# EAGLE schematic hackeeg-connector-32 (EAGLE 9.4.0)

## Sheet 1 of 4: HACKEEG 64 Position Connector Board
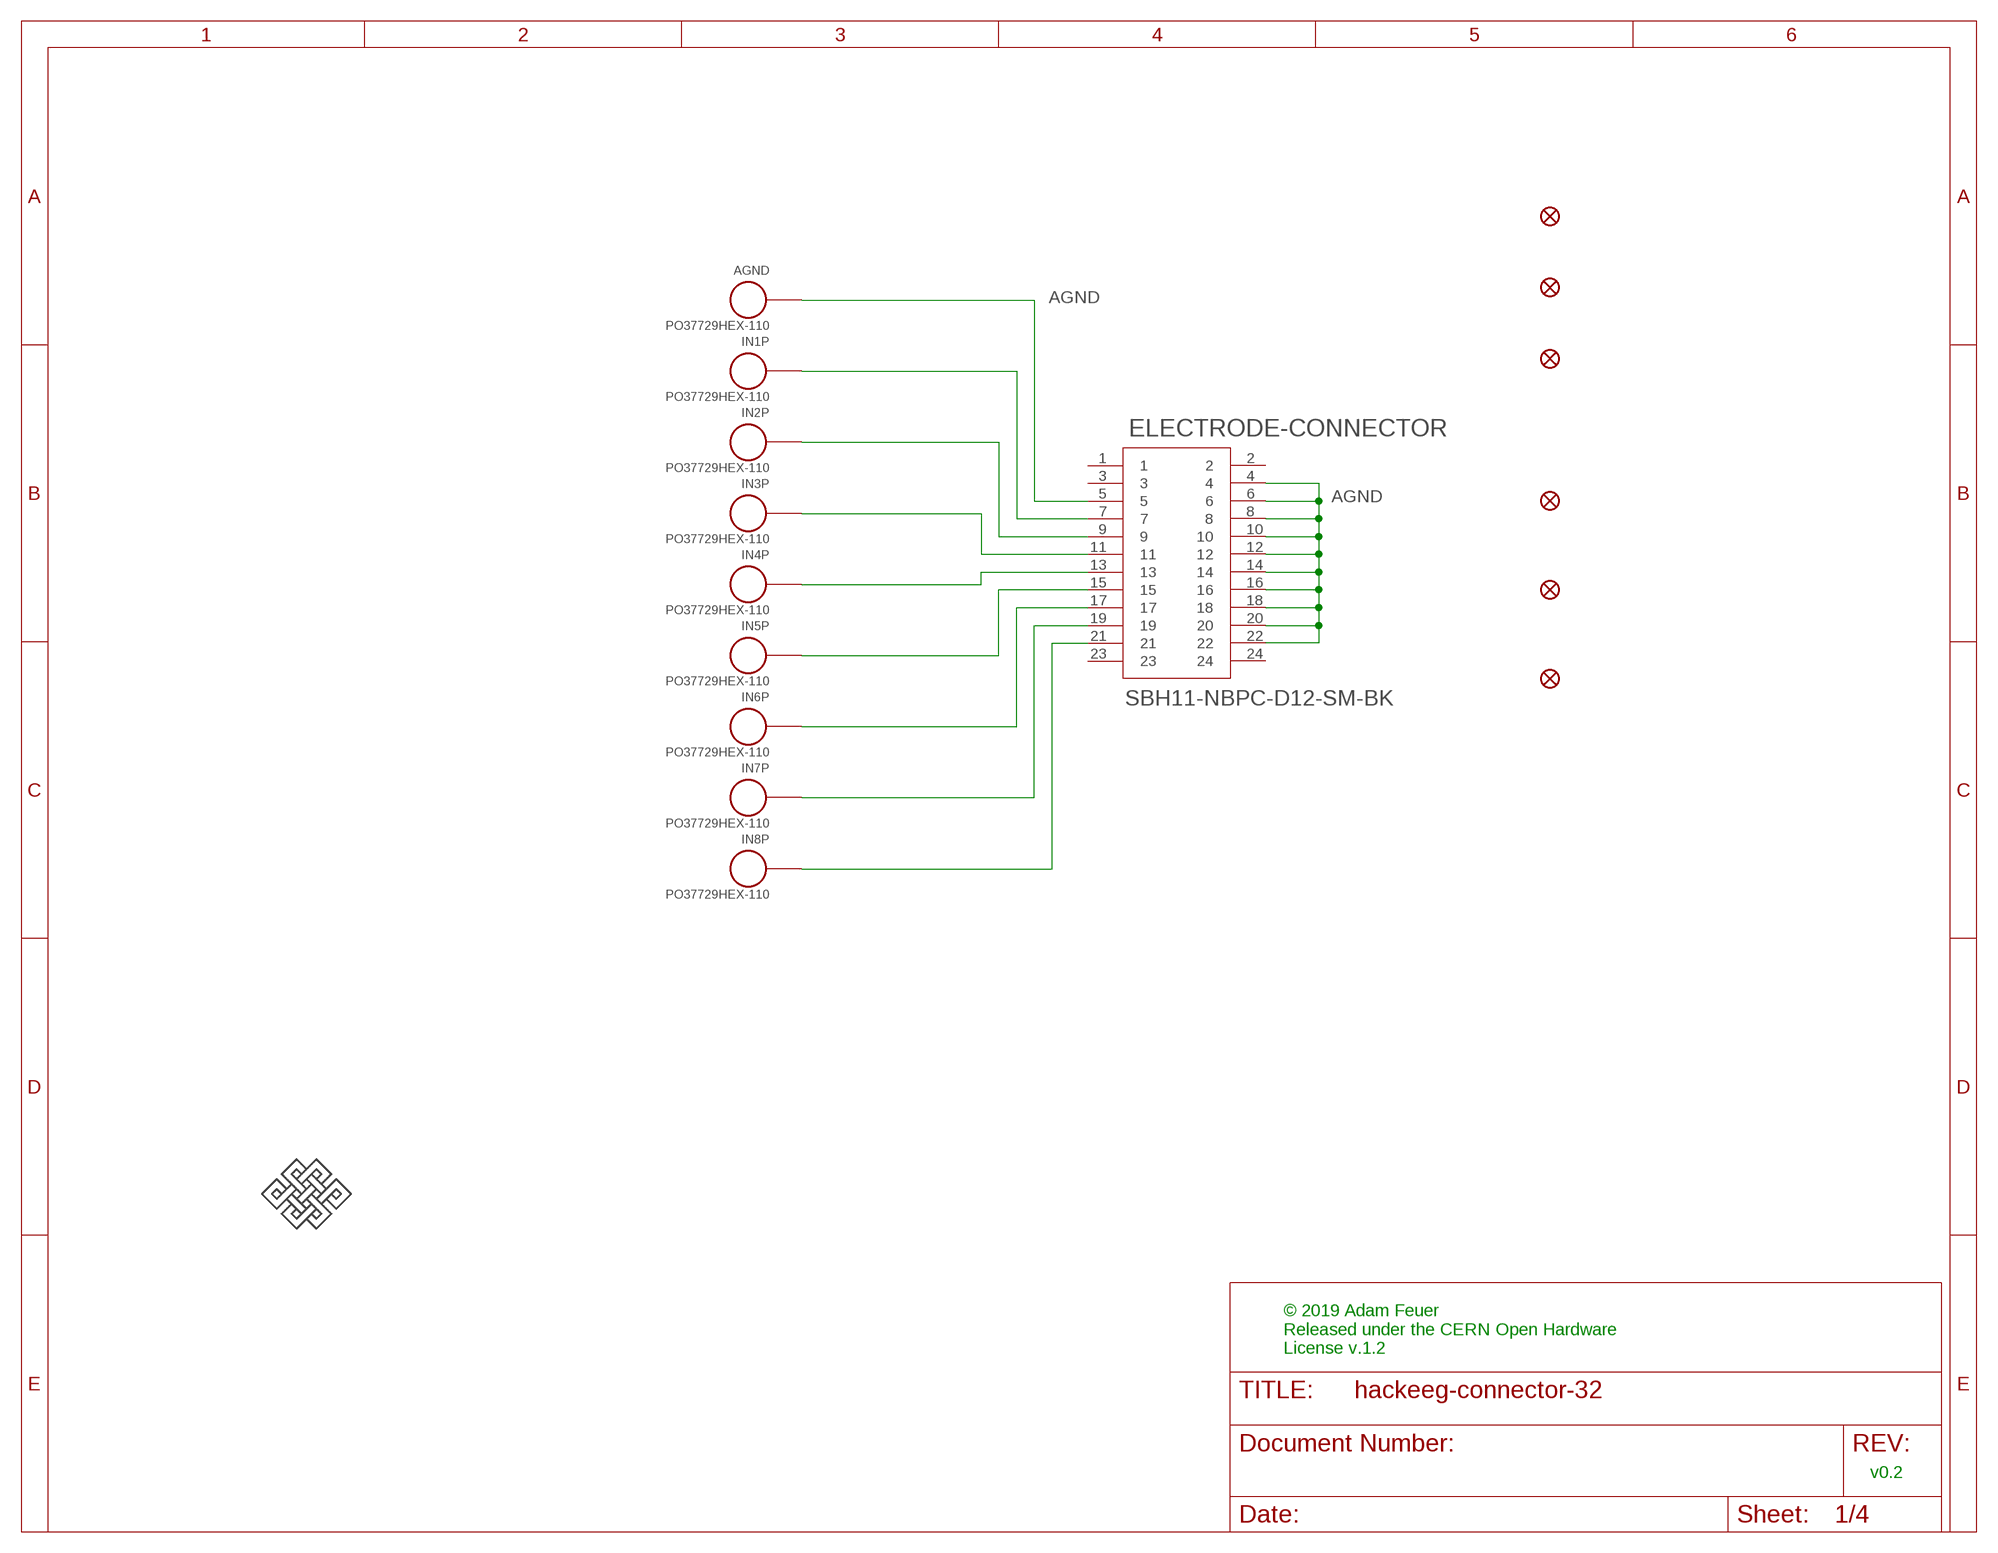
[diagram p0: schematic, sheet 1]

### Parts
AGND  PO37729HEX-110  [HEX-110]
ELECTRODE-CONNECTOR  SBH11-NBPC-D12-SM-BK  [SULLINS_SBH11-NBPC-D12-SM-BK]
FD1  FIDUCIAL1X2  [FIDUCIAL-1X2]
FD2  FIDUCIAL1X2  [FIDUCIAL-1X2]
FD3  FIDUCIAL1X2  [FIDUCIAL-1X2]
FD4  FIDUCIAL1X2  [FIDUCIAL-1X2]
FD5  FIDUCIAL1X2  [FIDUCIAL-1X2]
FD6  FIDUCIAL1X2  [FIDUCIAL-1X2]
IN1P  PO37729HEX-110  [HEX-110]
IN2P  PO37729HEX-110  [HEX-110]
IN3P  PO37729HEX-110  [HEX-110]
IN4P  PO37729HEX-110  [HEX-110]
IN5P  PO37729HEX-110  [HEX-110]
IN6P  PO37729HEX-110  [HEX-110]
IN7P  PO37729HEX-110  [HEX-110]
IN8P  PO37729HEX-110  [HEX-110]
U$1  ENDLESSKNOTENDLESSKNOT-MEDIUM  [ENDLESSKNOT-MEDIUM]

### Nets
AGND: AGND.SIGNAL ELECTRODE-CONNECTOR.4 ELECTRODE-CONNECTOR.5 ELECTRODE-CONNECTOR.6 ELECTRODE-CONNECTOR.8 ELECTRODE-CONNECTOR.10 ELECTRODE-CONNECTOR.12 ELECTRODE-CONNECTOR.14 ELECTRODE-CONNECTOR.16 ELECTRODE-CONNECTOR.18 ELECTRODE-CONNECTOR.20 ELECTRODE-CONNECTOR.22 ; also sheet 2,3,4
N$2: ELECTRODE-CONNECTOR.7 IN1P.SIGNAL
N$3: ELECTRODE-CONNECTOR.9 IN2P.SIGNAL
N$4: ELECTRODE-CONNECTOR.11 IN3P.SIGNAL
N$5: ELECTRODE-CONNECTOR.13 IN4P.SIGNAL
N$6: ELECTRODE-CONNECTOR.15 IN5P.SIGNAL
N$7: ELECTRODE-CONNECTOR.17 IN6P.SIGNAL
N$8: ELECTRODE-CONNECTOR.19 IN7P.SIGNAL
N$9: ELECTRODE-CONNECTOR.21 IN8P.SIGNAL
Unconnected: ELECTRODE-CONNECTOR.1 ELECTRODE-CONNECTOR.2 ELECTRODE-CONNECTOR.3 ELECTRODE-CONNECTOR.23 ELECTRODE-CONNECTOR.24

### Notes on the sheet
- © 2019 Adam Feuer
  Released under the CERN Open Hardware 
  License v.1.2
- v0.2

## Sheet 2 of 4
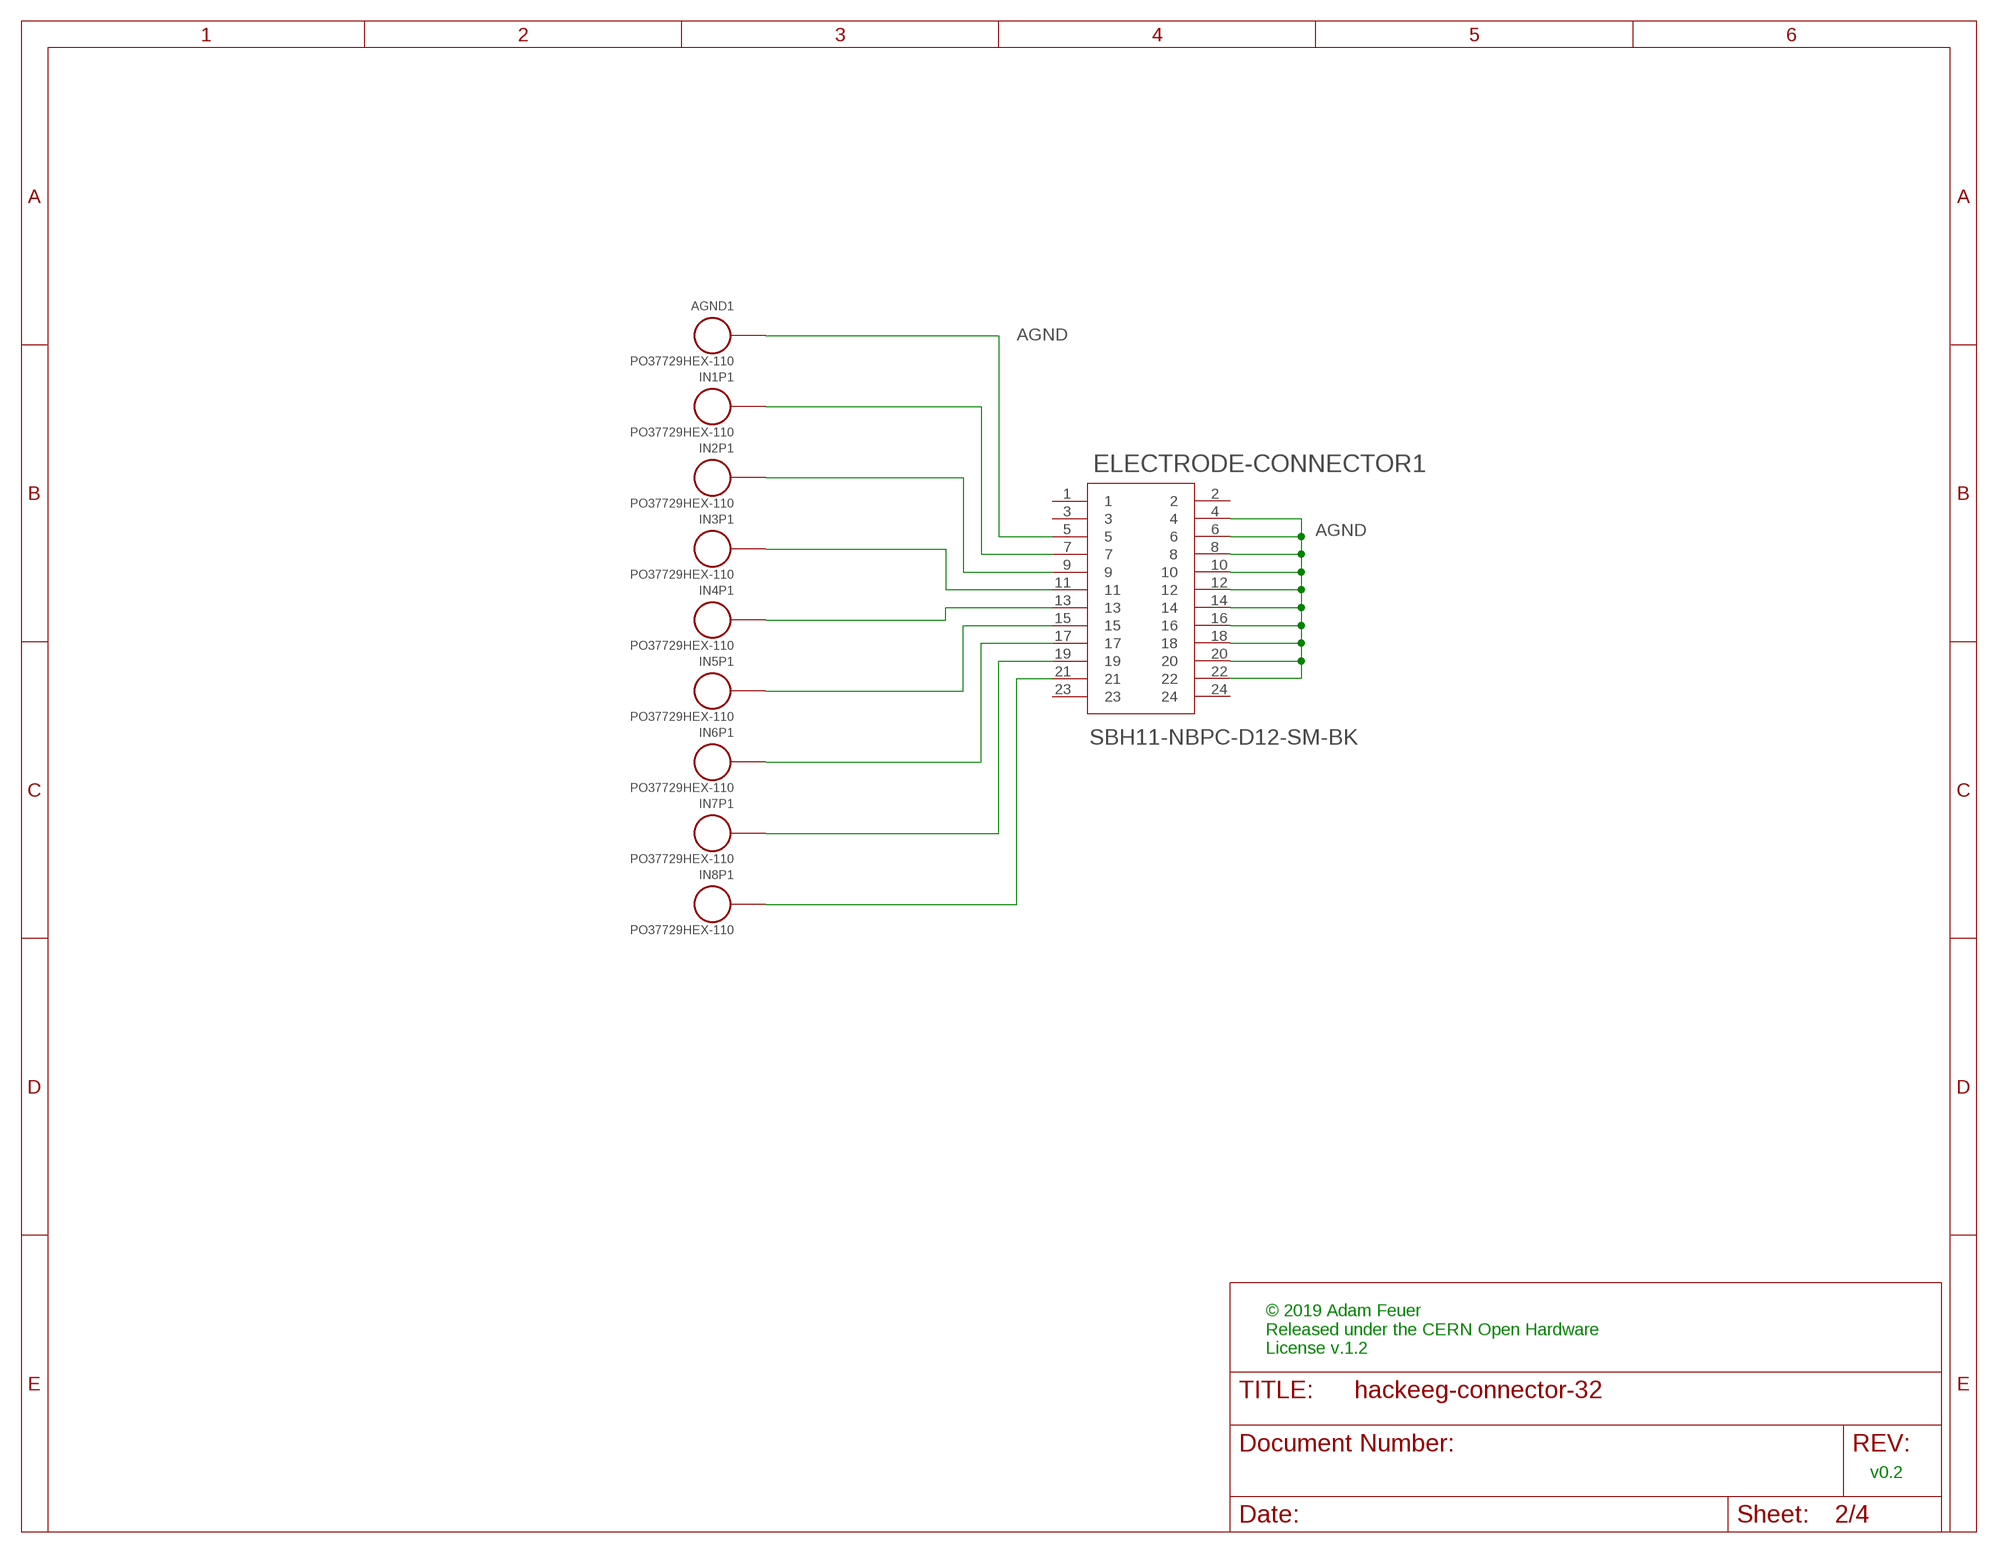
[diagram p1: schematic, sheet 2]

### Parts
AGND1  PO37729HEX-110  [HEX-110]
ELECTRODE-CONNECTOR1  SBH11-NBPC-D12-SM-BK  [SULLINS_SBH11-NBPC-D12-SM-BK]
IN1P1  PO37729HEX-110  [HEX-110]
IN2P1  PO37729HEX-110  [HEX-110]
IN3P1  PO37729HEX-110  [HEX-110]
IN4P1  PO37729HEX-110  [HEX-110]
IN5P1  PO37729HEX-110  [HEX-110]
IN6P1  PO37729HEX-110  [HEX-110]
IN7P1  PO37729HEX-110  [HEX-110]
IN8P1  PO37729HEX-110  [HEX-110]

### Nets
AGND: AGND1.SIGNAL ELECTRODE-CONNECTOR1.4 ELECTRODE-CONNECTOR1.5 ELECTRODE-CONNECTOR1.6 ELECTRODE-CONNECTOR1.8 ELECTRODE-CONNECTOR1.10 ELECTRODE-CONNECTOR1.12 ELECTRODE-CONNECTOR1.14 ELECTRODE-CONNECTOR1.16 ELECTRODE-CONNECTOR1.18 ELECTRODE-CONNECTOR1.20 ELECTRODE-CONNECTOR1.22 ; also sheet 1,3,4
N$11: ELECTRODE-CONNECTOR1.7 IN1P1.SIGNAL
N$12: ELECTRODE-CONNECTOR1.9 IN2P1.SIGNAL
N$13: ELECTRODE-CONNECTOR1.11 IN3P1.SIGNAL
N$14: ELECTRODE-CONNECTOR1.13 IN4P1.SIGNAL
N$15: ELECTRODE-CONNECTOR1.15 IN5P1.SIGNAL
N$16: ELECTRODE-CONNECTOR1.17 IN6P1.SIGNAL
N$17: ELECTRODE-CONNECTOR1.19 IN7P1.SIGNAL
N$18: ELECTRODE-CONNECTOR1.21 IN8P1.SIGNAL
Unconnected: ELECTRODE-CONNECTOR1.1 ELECTRODE-CONNECTOR1.2 ELECTRODE-CONNECTOR1.3 ELECTRODE-CONNECTOR1.23 ELECTRODE-CONNECTOR1.24

### Notes on the sheet
- © 2019 Adam Feuer
  Released under the CERN Open Hardware 
  License v.1.2
- v0.2

## Sheet 3 of 4
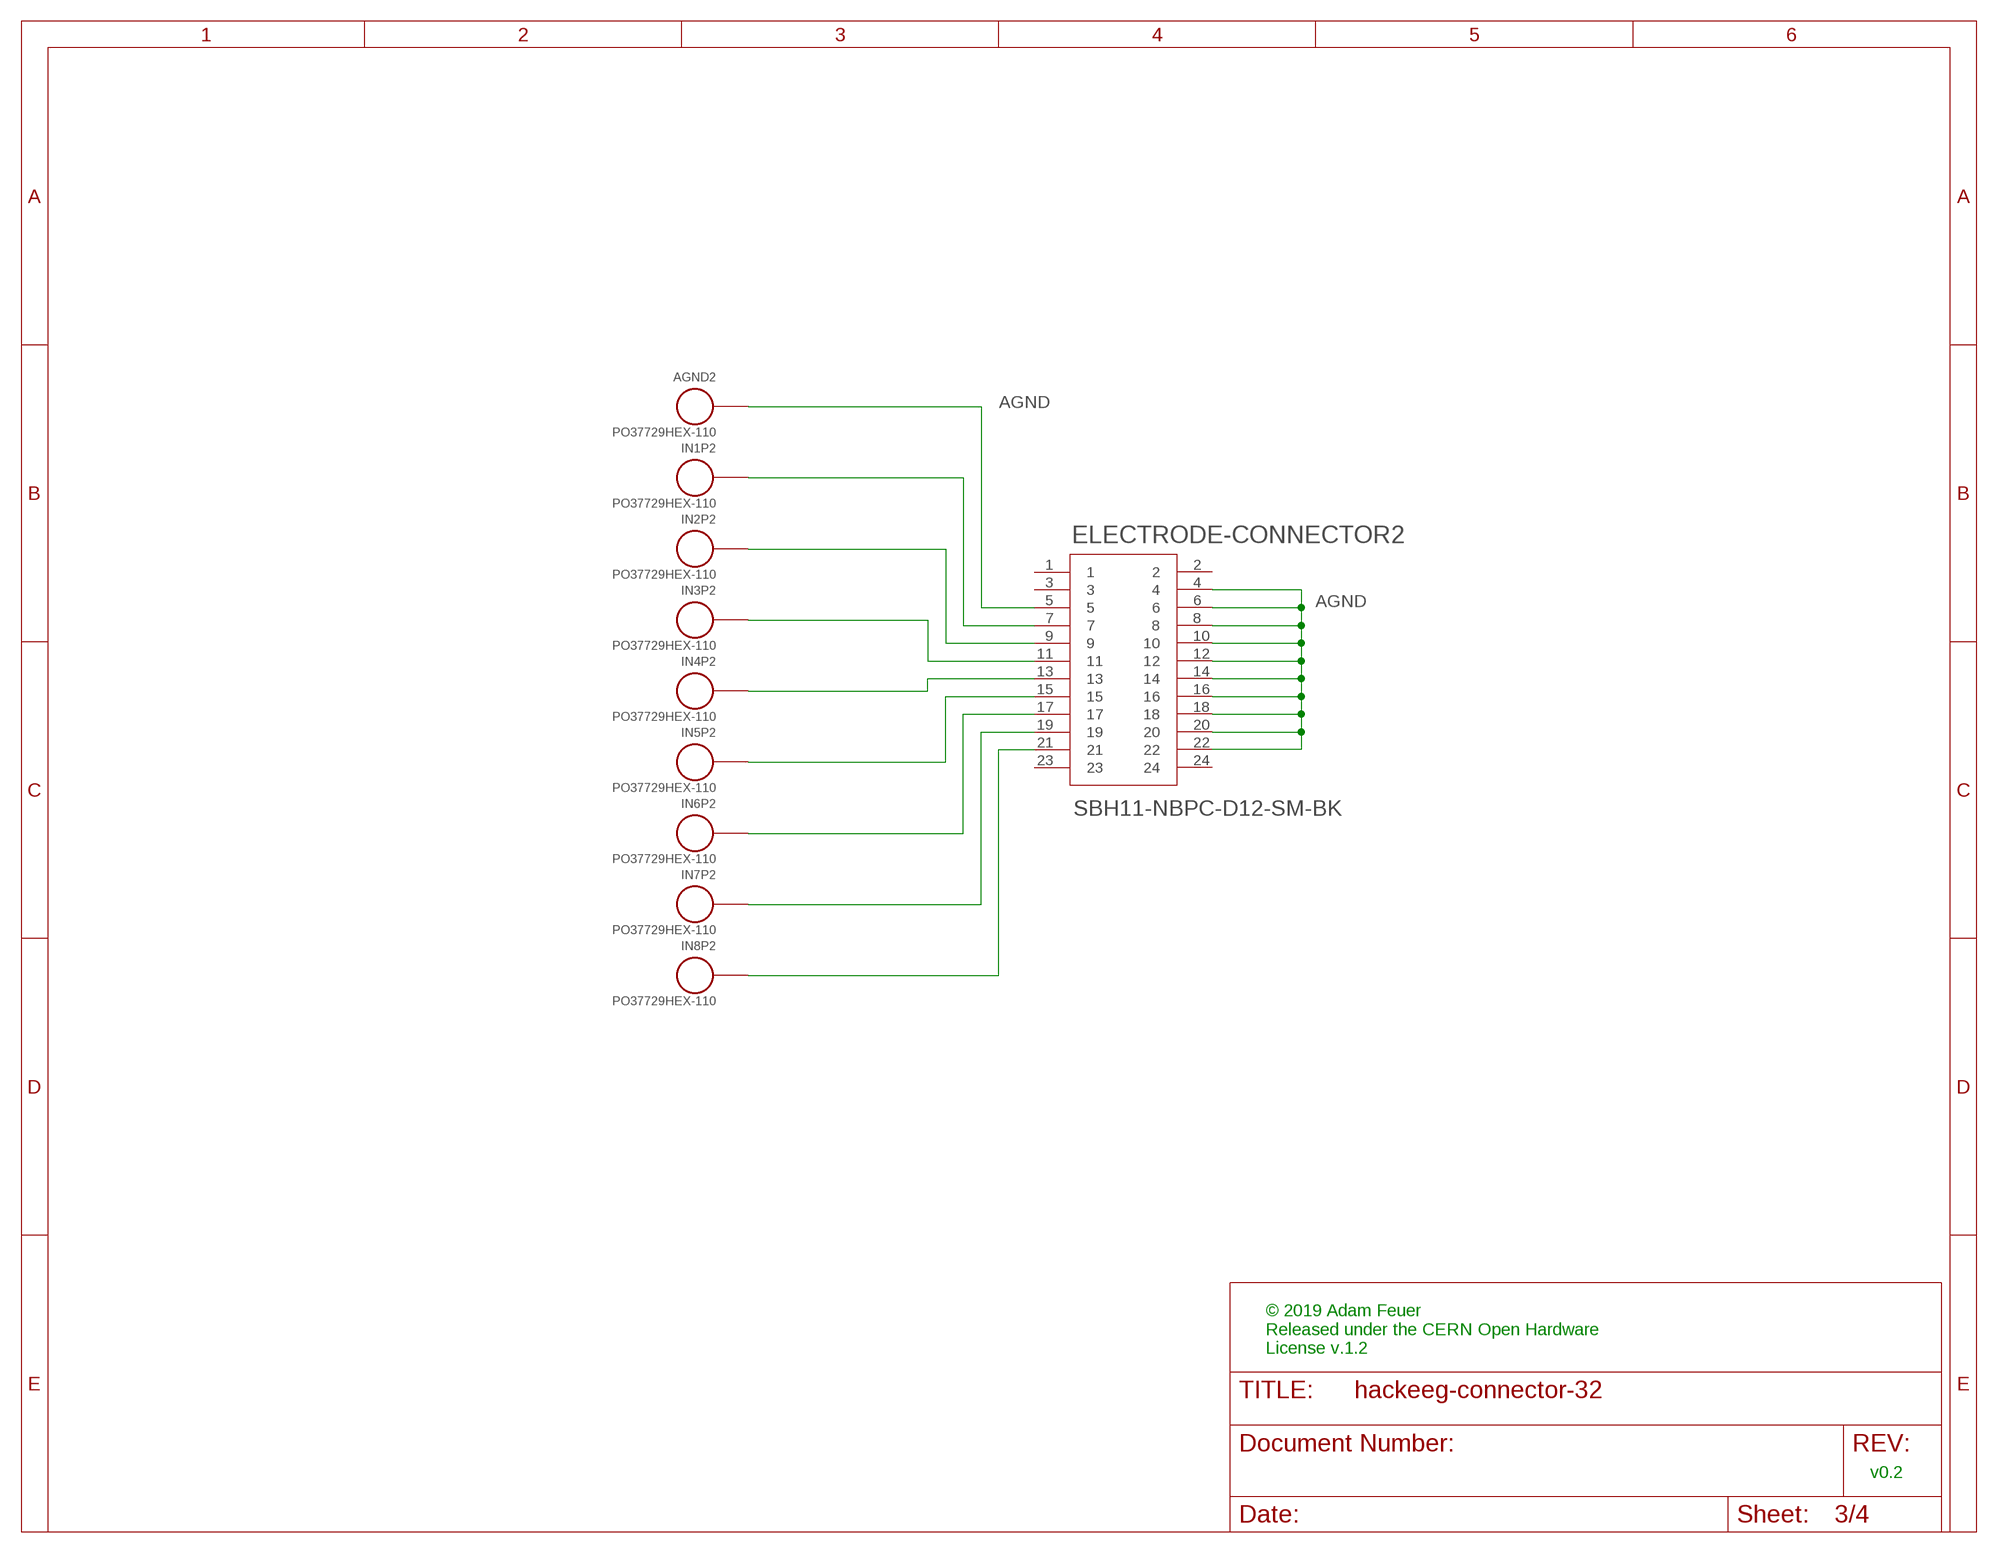
[diagram p2: schematic, sheet 3]

### Parts
AGND2  PO37729HEX-110  [HEX-110]
ELECTRODE-CONNECTOR2  SBH11-NBPC-D12-SM-BK  [SULLINS_SBH11-NBPC-D12-SM-BK]
IN1P2  PO37729HEX-110  [HEX-110]
IN2P2  PO37729HEX-110  [HEX-110]
IN3P2  PO37729HEX-110  [HEX-110]
IN4P2  PO37729HEX-110  [HEX-110]
IN5P2  PO37729HEX-110  [HEX-110]
IN6P2  PO37729HEX-110  [HEX-110]
IN7P2  PO37729HEX-110  [HEX-110]
IN8P2  PO37729HEX-110  [HEX-110]

### Nets
AGND: AGND2.SIGNAL ELECTRODE-CONNECTOR2.4 ELECTRODE-CONNECTOR2.5 ELECTRODE-CONNECTOR2.6 ELECTRODE-CONNECTOR2.8 ELECTRODE-CONNECTOR2.10 ELECTRODE-CONNECTOR2.12 ELECTRODE-CONNECTOR2.14 ELECTRODE-CONNECTOR2.16 ELECTRODE-CONNECTOR2.18 ELECTRODE-CONNECTOR2.20 ELECTRODE-CONNECTOR2.22 ; also sheet 1,2,4
N$20: ELECTRODE-CONNECTOR2.7 IN1P2.SIGNAL
N$21: ELECTRODE-CONNECTOR2.9 IN2P2.SIGNAL
N$22: ELECTRODE-CONNECTOR2.11 IN3P2.SIGNAL
N$23: ELECTRODE-CONNECTOR2.13 IN4P2.SIGNAL
N$24: ELECTRODE-CONNECTOR2.15 IN5P2.SIGNAL
N$25: ELECTRODE-CONNECTOR2.17 IN6P2.SIGNAL
N$26: ELECTRODE-CONNECTOR2.19 IN7P2.SIGNAL
N$27: ELECTRODE-CONNECTOR2.21 IN8P2.SIGNAL
Unconnected: ELECTRODE-CONNECTOR2.1 ELECTRODE-CONNECTOR2.2 ELECTRODE-CONNECTOR2.3 ELECTRODE-CONNECTOR2.23 ELECTRODE-CONNECTOR2.24

### Notes on the sheet
- © 2019 Adam Feuer
  Released under the CERN Open Hardware 
  License v.1.2
- v0.2

## Sheet 4 of 4
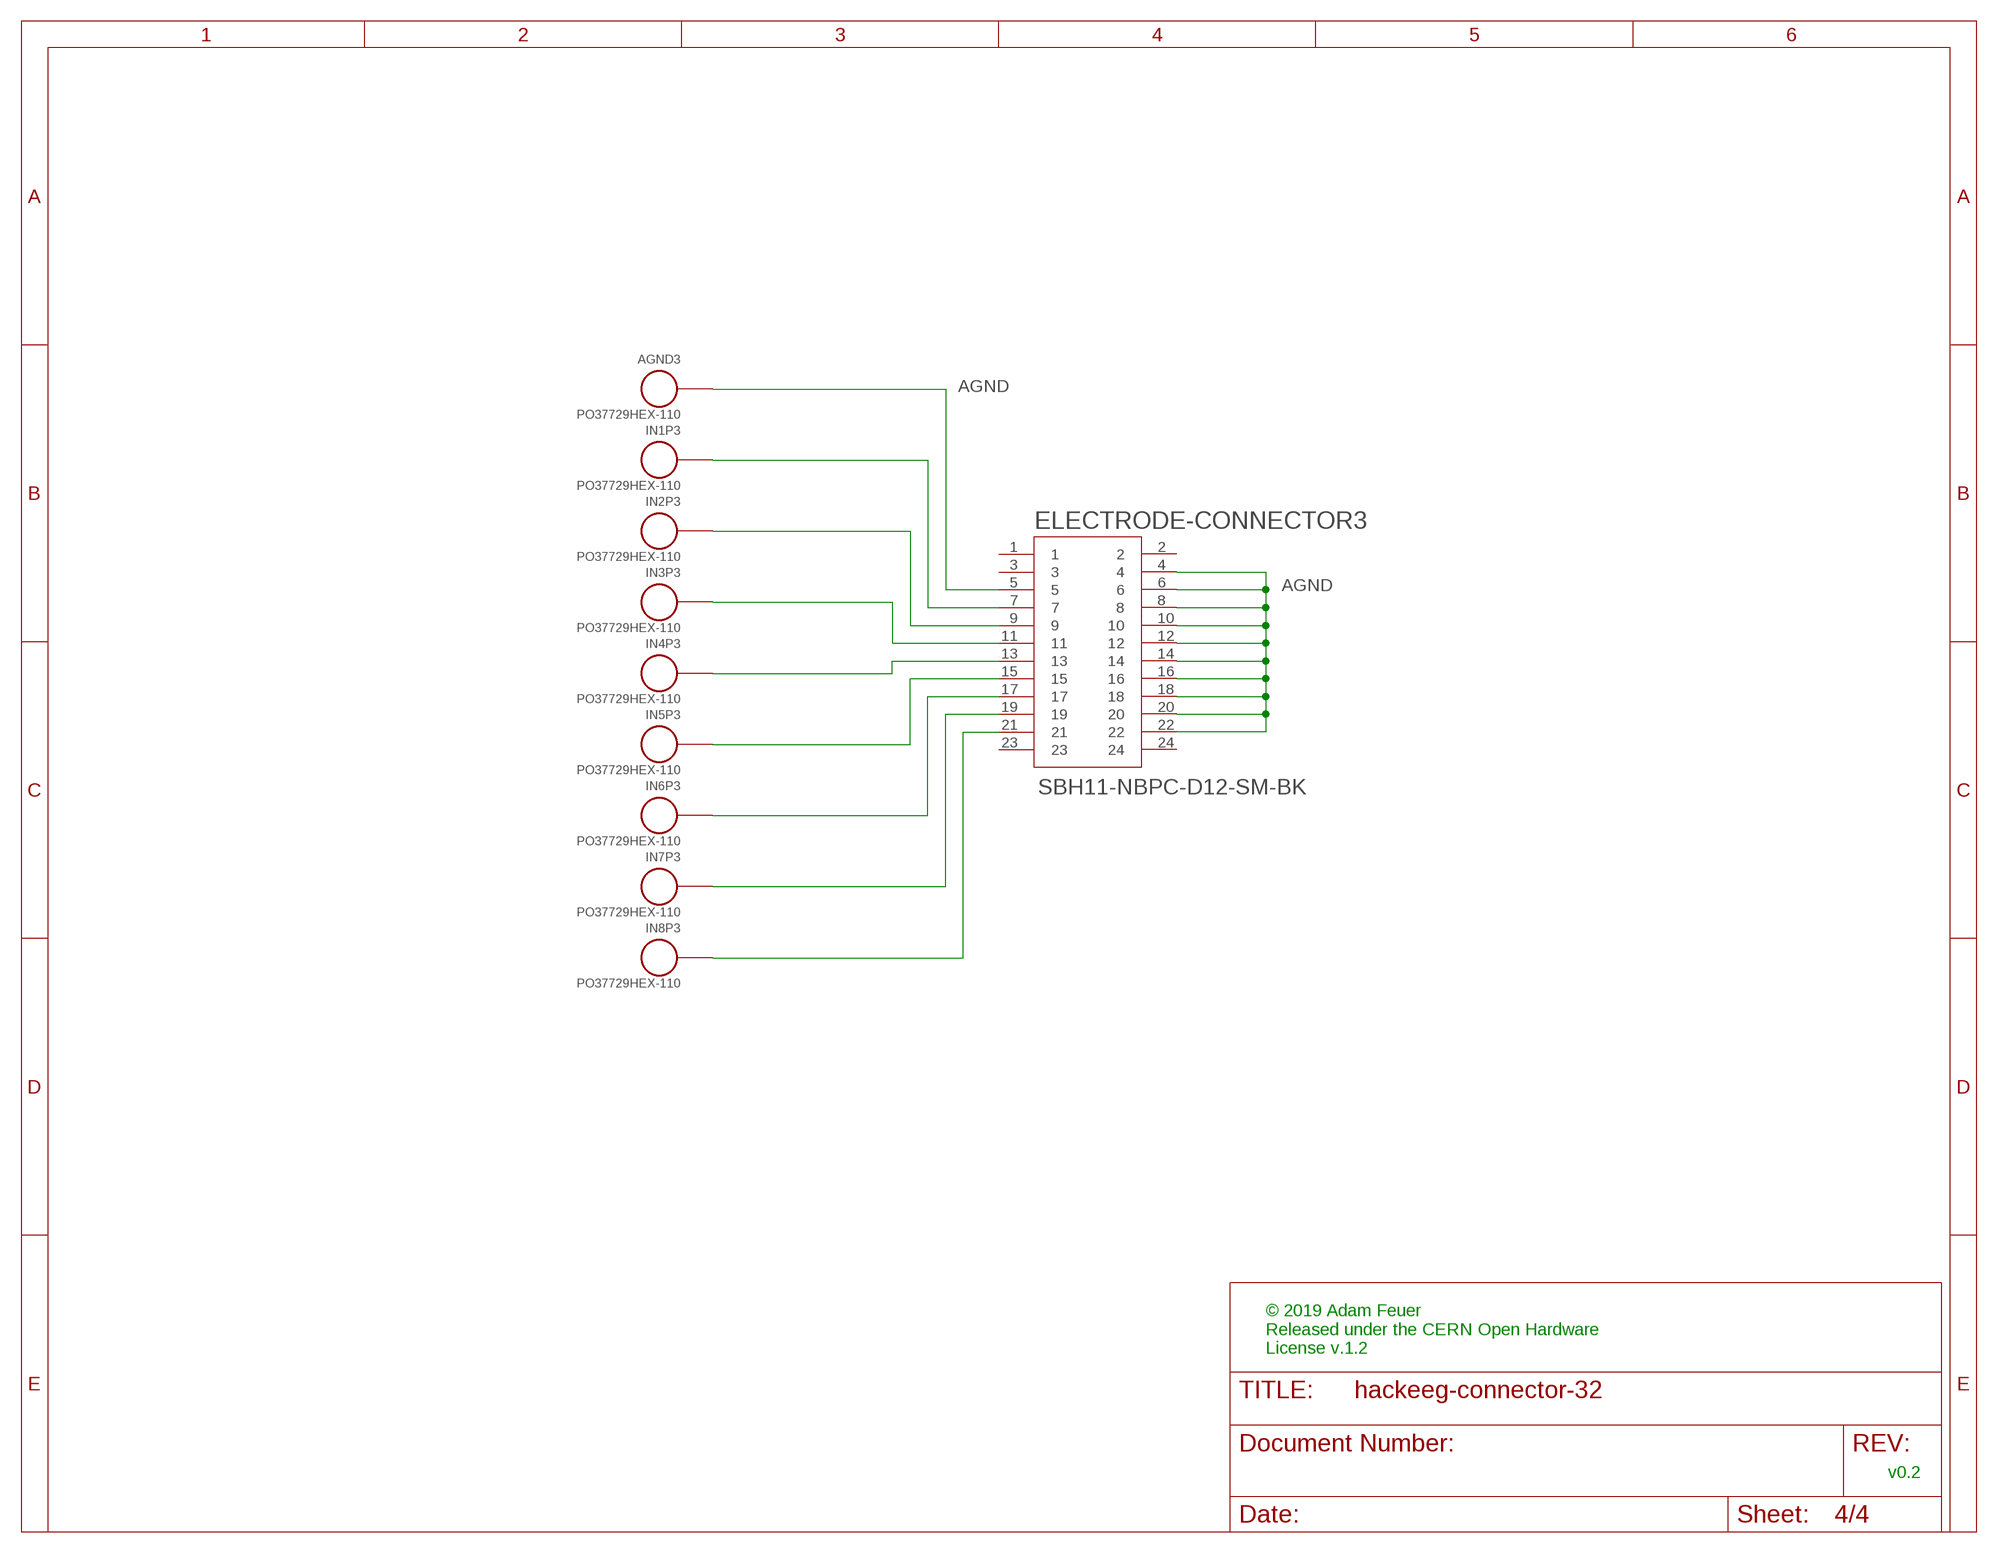
[diagram p3: schematic, sheet 4]

### Parts
AGND3  PO37729HEX-110  [HEX-110]
ELECTRODE-CONNECTOR3  SBH11-NBPC-D12-SM-BK  [SULLINS_SBH11-NBPC-D12-SM-BK]
IN1P3  PO37729HEX-110  [HEX-110]
IN2P3  PO37729HEX-110  [HEX-110]
IN3P3  PO37729HEX-110  [HEX-110]
IN4P3  PO37729HEX-110  [HEX-110]
IN5P3  PO37729HEX-110  [HEX-110]
IN6P3  PO37729HEX-110  [HEX-110]
IN7P3  PO37729HEX-110  [HEX-110]
IN8P3  PO37729HEX-110  [HEX-110]

### Nets
AGND: AGND3.SIGNAL ELECTRODE-CONNECTOR3.4 ELECTRODE-CONNECTOR3.5 ELECTRODE-CONNECTOR3.6 ELECTRODE-CONNECTOR3.8 ELECTRODE-CONNECTOR3.10 ELECTRODE-CONNECTOR3.12 ELECTRODE-CONNECTOR3.14 ELECTRODE-CONNECTOR3.16 ELECTRODE-CONNECTOR3.18 ELECTRODE-CONNECTOR3.20 ELECTRODE-CONNECTOR3.22 ; also sheet 1,2,3
N$29: ELECTRODE-CONNECTOR3.7 IN1P3.SIGNAL
N$30: ELECTRODE-CONNECTOR3.9 IN2P3.SIGNAL
N$31: ELECTRODE-CONNECTOR3.11 IN3P3.SIGNAL
N$32: ELECTRODE-CONNECTOR3.13 IN4P3.SIGNAL
N$33: ELECTRODE-CONNECTOR3.15 IN5P3.SIGNAL
N$34: ELECTRODE-CONNECTOR3.17 IN6P3.SIGNAL
N$35: ELECTRODE-CONNECTOR3.19 IN7P3.SIGNAL
N$36: ELECTRODE-CONNECTOR3.21 IN8P3.SIGNAL
Unconnected: ELECTRODE-CONNECTOR3.1 ELECTRODE-CONNECTOR3.2 ELECTRODE-CONNECTOR3.3 ELECTRODE-CONNECTOR3.23 ELECTRODE-CONNECTOR3.24

### Notes on the sheet
- © 2019 Adam Feuer
  Released under the CERN Open Hardware 
  License v.1.2
- v0.2

## Library data of the parts
AGND AGND1-AGND3 IN1P IN1P1-IN1P3 IN2P IN2P1-IN2P3 IN3P IN3P1-IN3P3 IN4P IN4P1-IN4P3 IN5P IN5P1-IN5P3 IN6P IN6P1-IN6P3 IN7P IN7P1-IN7P3 IN8P IN8P1-IN8P3 = po-37729:PO37729: Plastics One 37729 - DIN 42-802 female vertical jack
ELECTRODE-CONNECTOR ELECTRODE-CONNECTOR1-ELECTRODE-CONNECTOR3 = SBH11-NBPC-D12-SM-BK:SBH11-NBPC-D12-SM-BK: Conn Headr 2.54mm 24pos Gold Smd; AVAILABILITY: Warning; DESCRIPTION: Conn Headr 2.54mm 24pos Gold Smd; MF: Sullins Connector; MP: SBH11-NBPC-D12-SM-BK; PACKAGE: None; PRICE: 1.05 USD
FD1-FD6 = SparkFun-Aesthetics:FIDUCIAL: Fiducial Alignment Points Point-of-reference for pick-and-place machines and other optical instruments.
U$1 = endless-knot:ENDLESSKNOT